# EAGLE design Power PCB final (EAGLE 6.1)
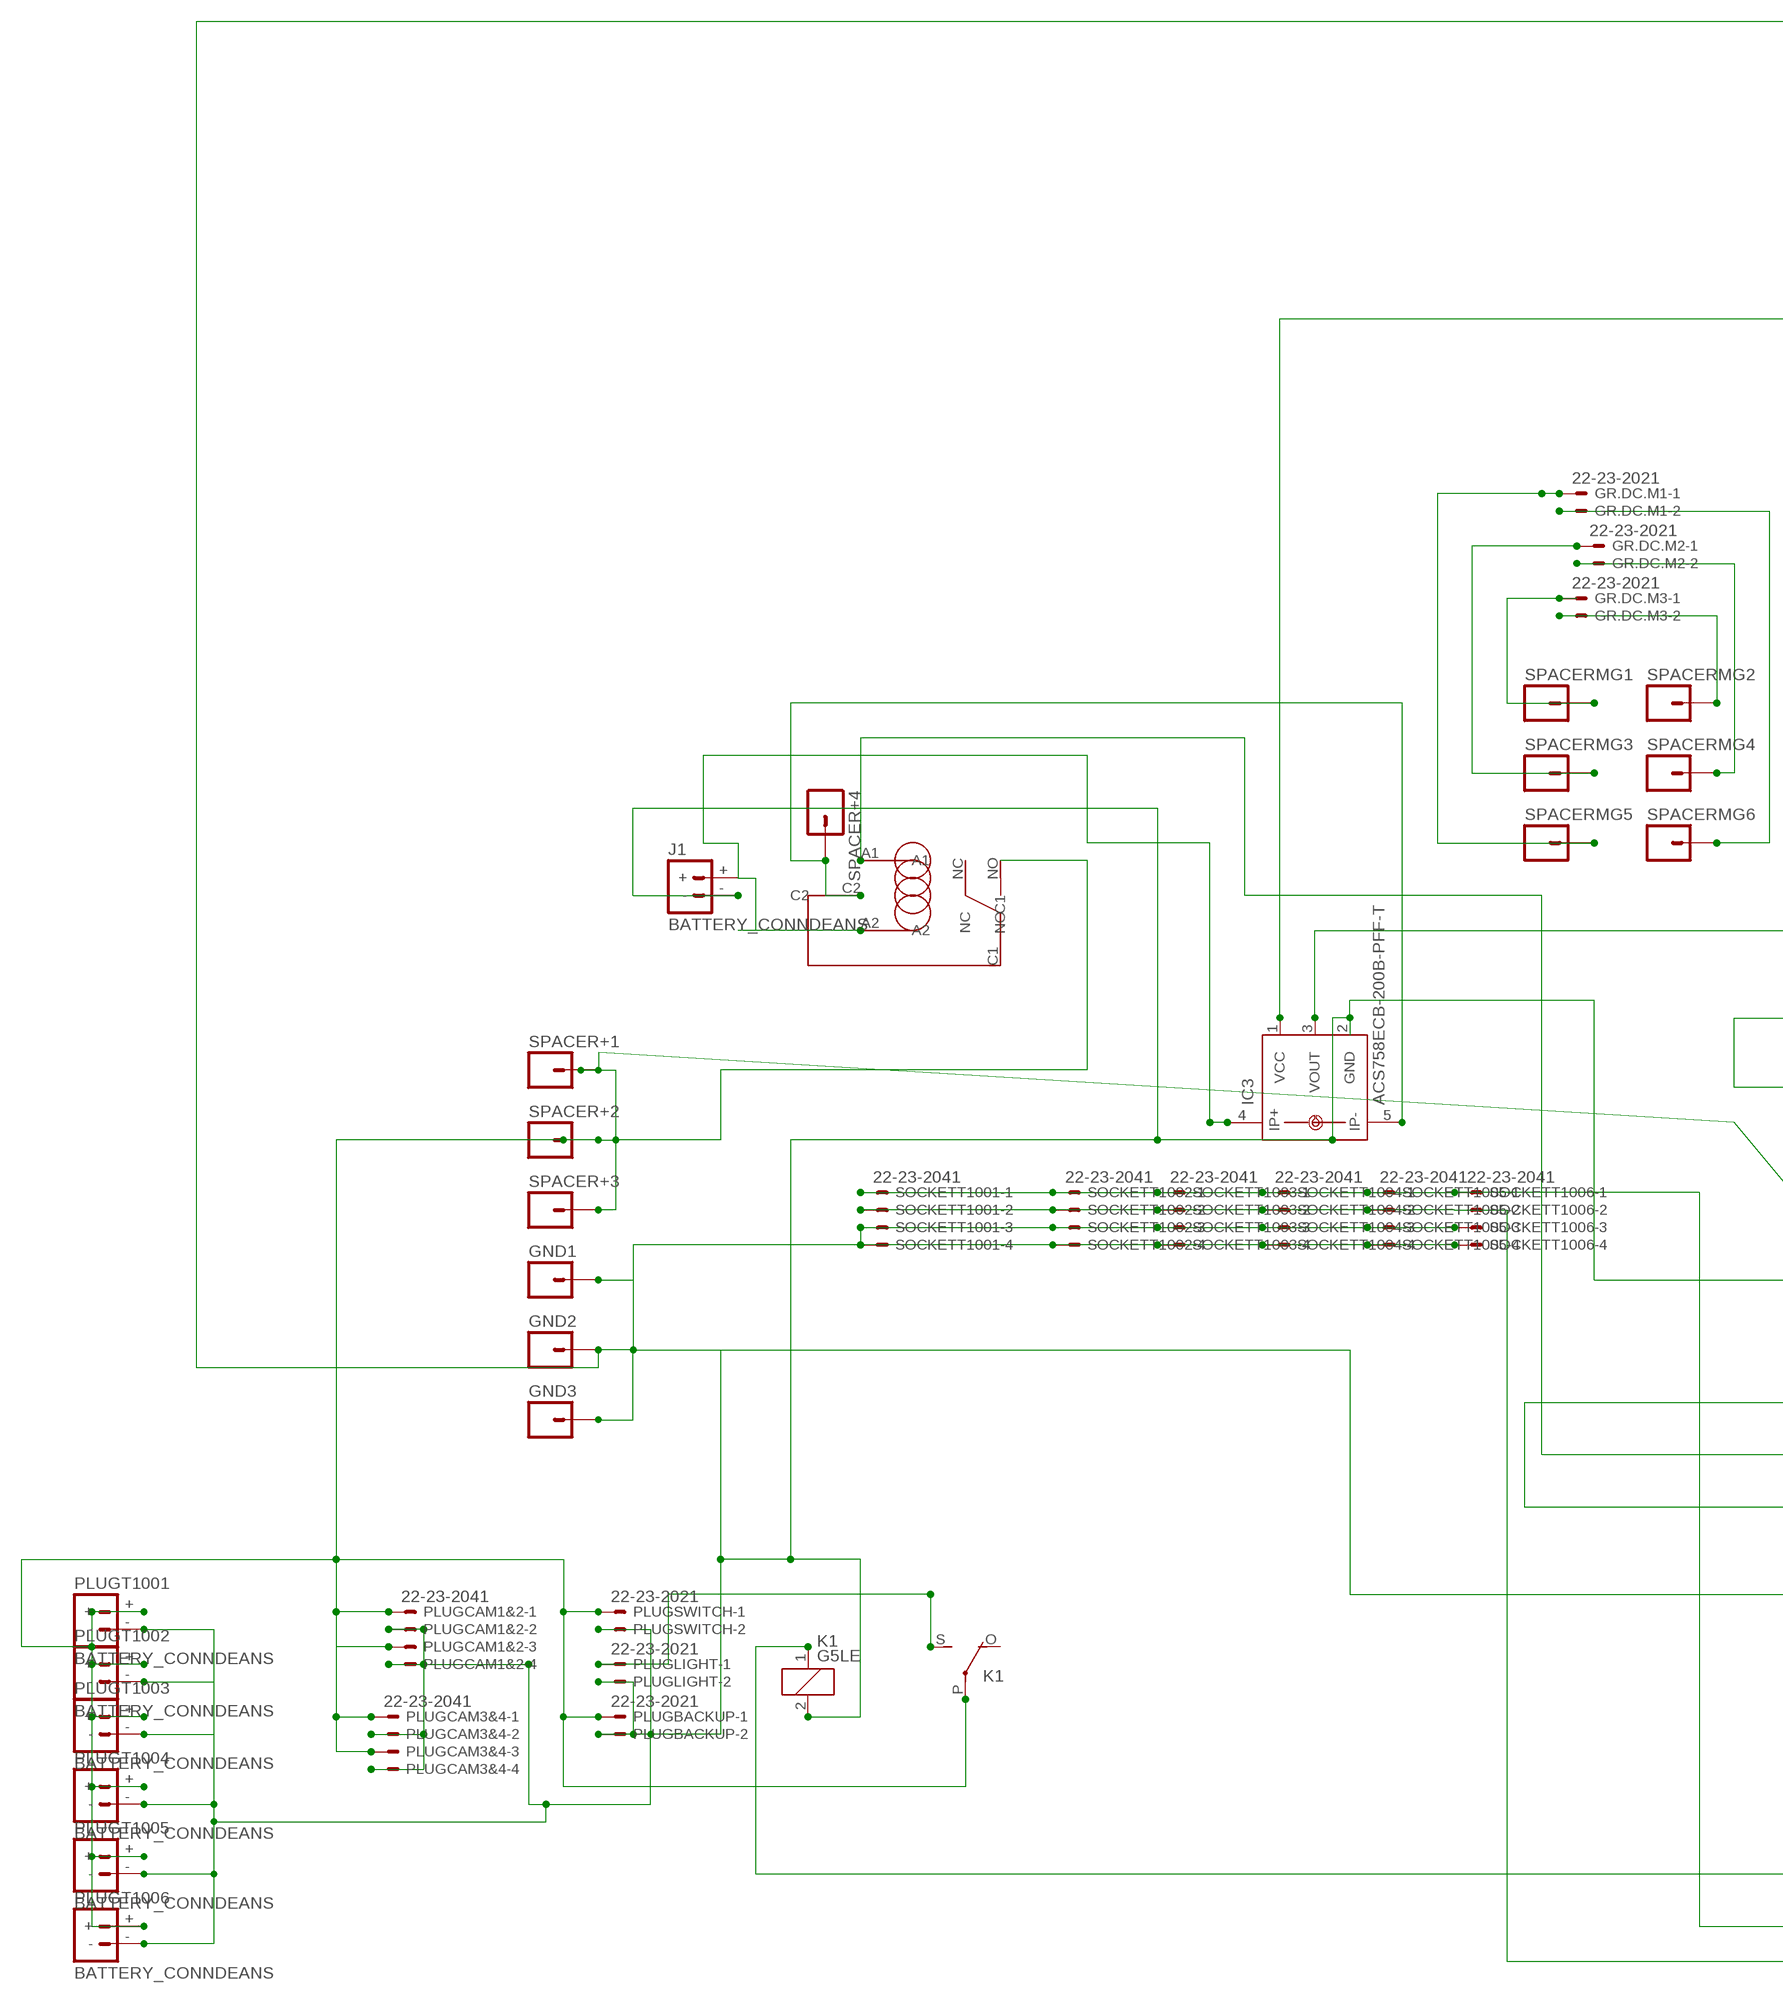
[diagram p0: schematic, sheet 1, part 1 of 2]
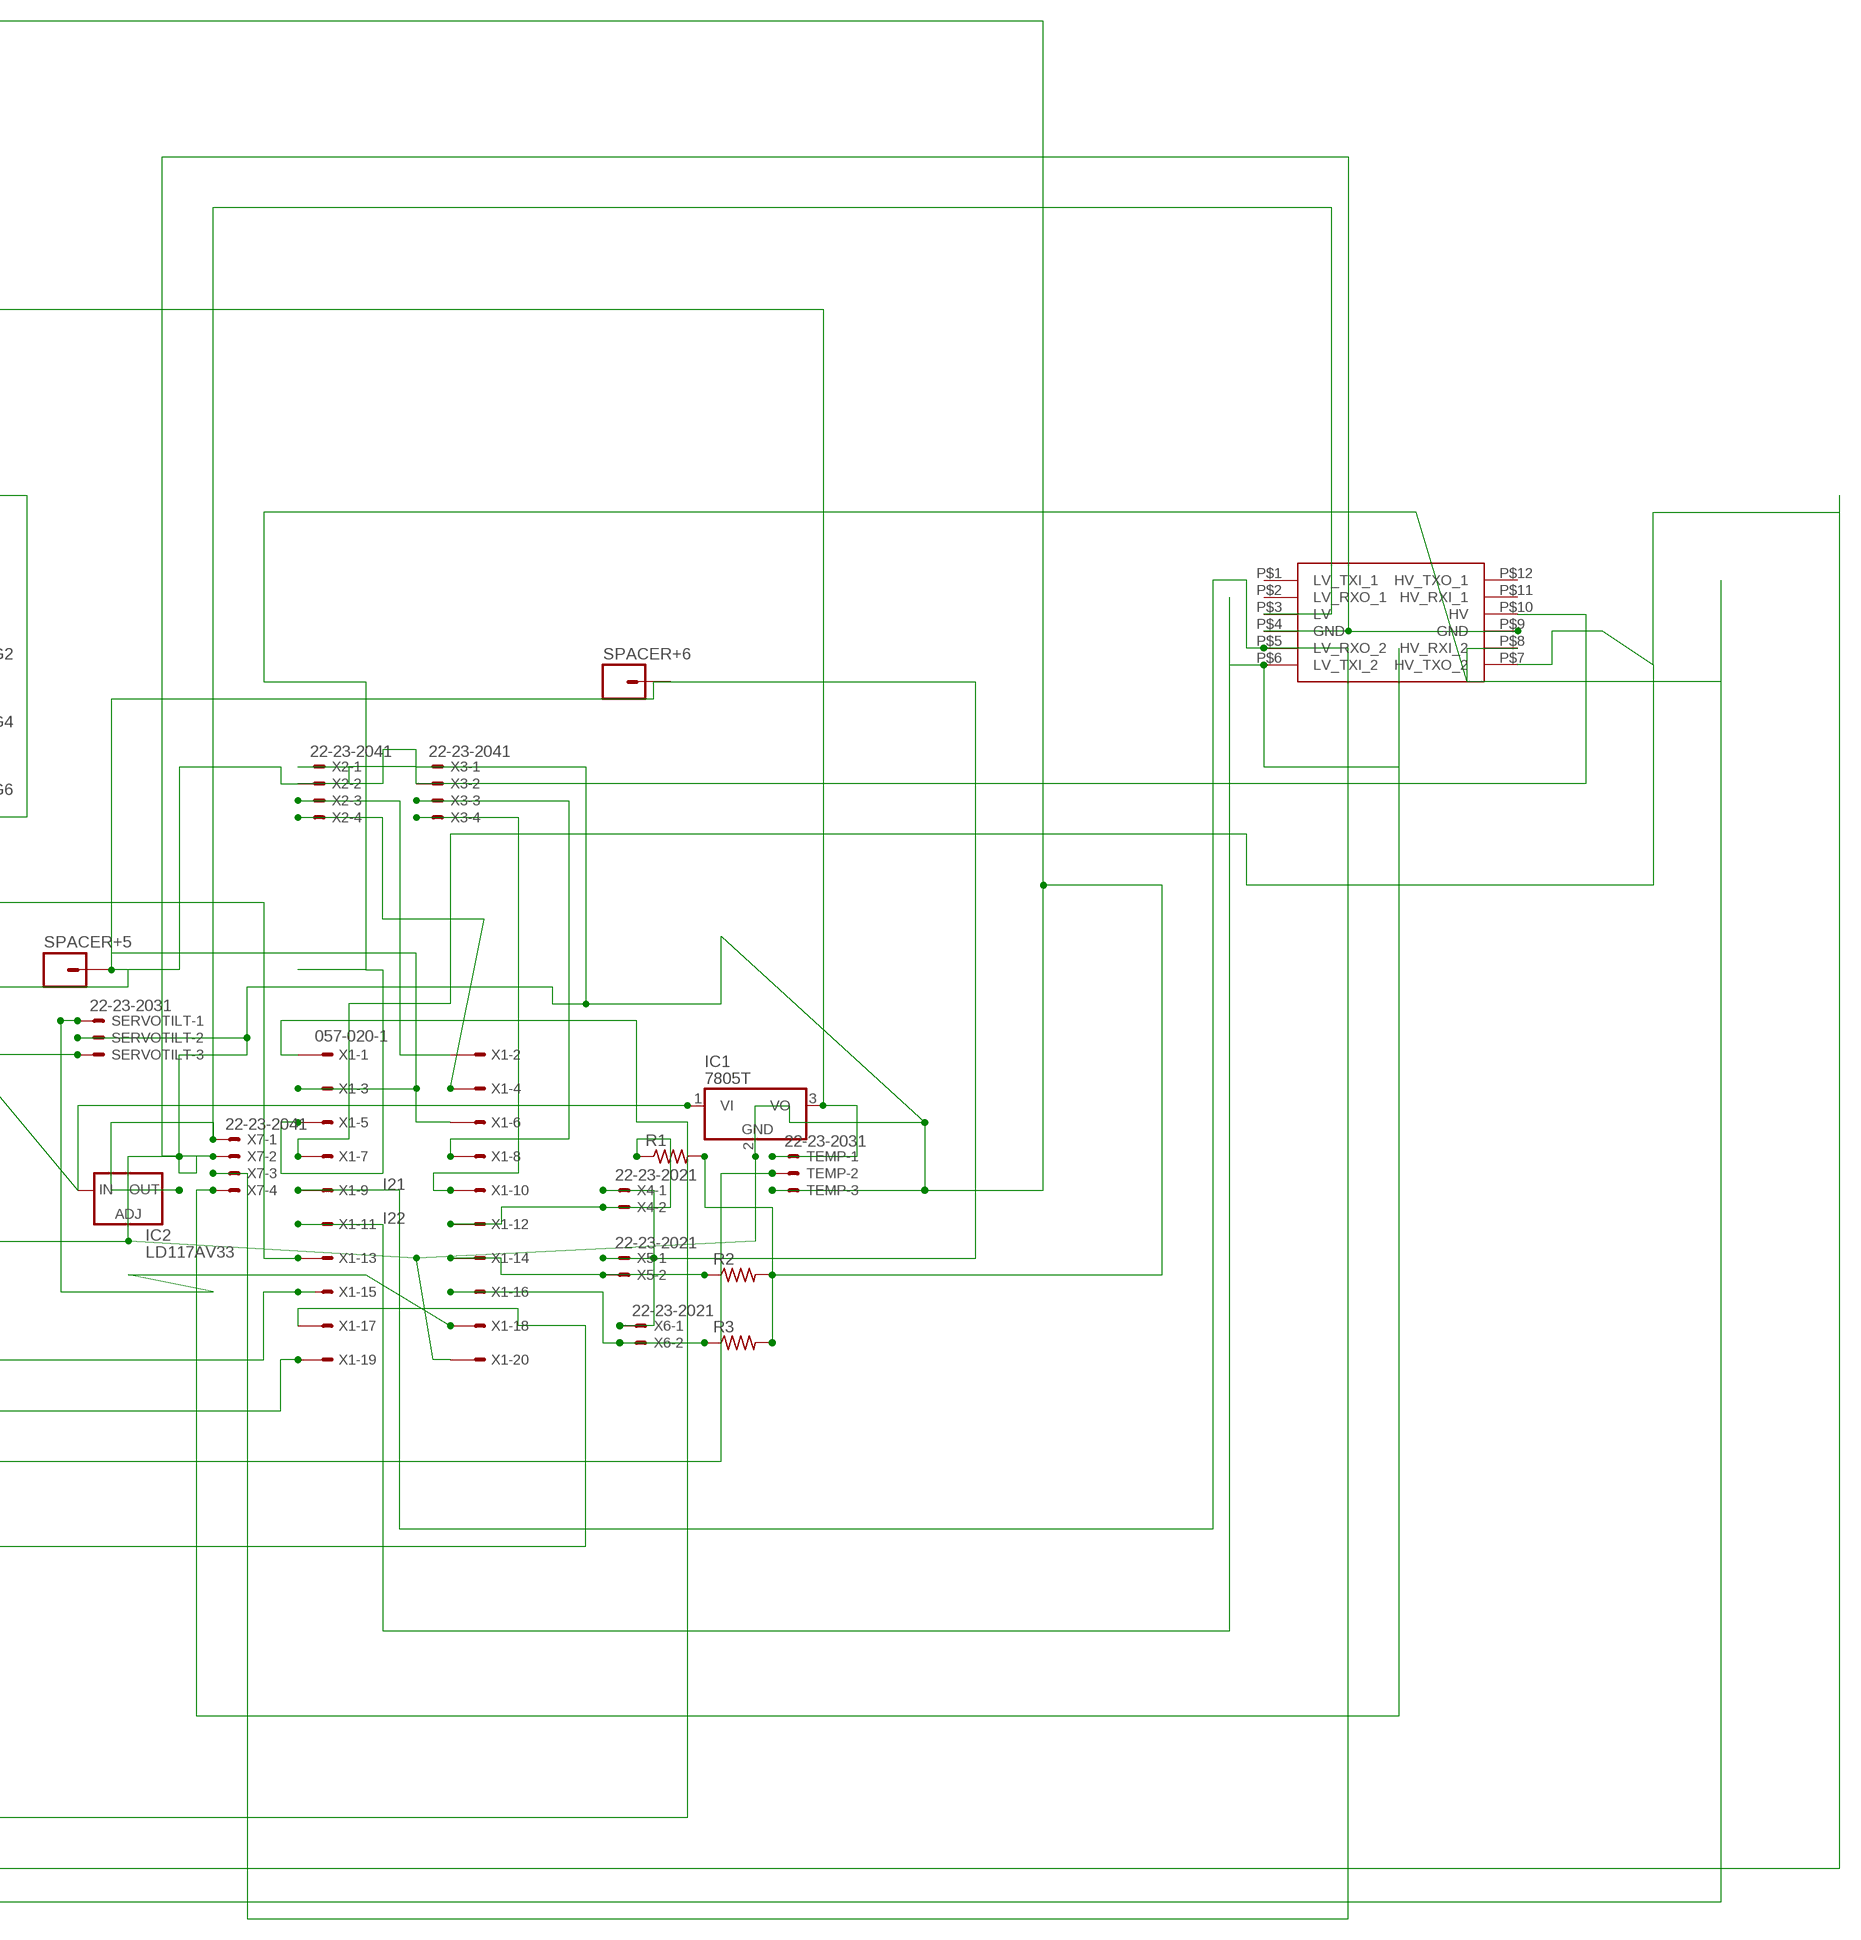
[diagram p1: schematic, sheet 1, part 2 of 2]

## Parts
GND1  M01PTH_2MM  [1X01_2MM]
GND2  M01PTH_2MM  [1X01_2MM]
GND3  M01PTH_2MM  [1X01_2MM]
GR.DC.M1  22-23-2021  [22-23-2021]
GR.DC.M2  22-23-2021  [22-23-2021]
GR.DC.M3  22-23-2021  [22-23-2021]
IC1  7805T  [TO220H]
IC2  LD117AV33  [TO220L1]
IC3  ACS758ECB-200B-PFF-T  [CB-PFF]
J1  BATTERY_CONNDEANS  [DEANS]
K1  G5LE  [G5LE]
PLUGBACKUP  22-23-2021  [22-23-2021]
PLUGCAM1&2  22-23-2041  [22-23-2041]
PLUGCAM3&4  22-23-2041  [22-23-2041]
PLUGLIGHT  22-23-2021  [22-23-2021]
PLUGSWITCH  22-23-2021  [22-23-2021]
PLUGT1001  BATTERY_CONNDEANS  [DEANS]
PLUGT1002  BATTERY_CONNDEANS  [DEANS]
PLUGT1003  BATTERY_CONNDEANS  [DEANS]
PLUGT1004  BATTERY_CONNDEANS  [DEANS]
PLUGT1005  BATTERY_CONNDEANS  [DEANS]
PLUGT1006  BATTERY_CONNDEANS  [DEANS]
R1  R-US_0207/10  [0207/10]
R2  R-US_0207/10  [0207/10]
R3  R-US_0207/10  [0207/10]
SERVOTILT  22-23-2031  [22-23-2031]
SOCKETT1001  22-23-2041  [22-23-2041]
SOCKETT1002  22-23-2041  [22-23-2041]
SOCKETT1003  22-23-2041  [22-23-2041]
SOCKETT1004  22-23-2041  [22-23-2041]
SOCKETT1005  22-23-2041  [22-23-2041]
SOCKETT1006  22-23-2041  [22-23-2041]
SPACER+1  M01PTH_2MM  [1X01_2MM]
SPACER+2  M01PTH_2MM  [1X01_2MM]
SPACER+3  M01PTH_2MM  [1X01_2MM]
SPACER+4  M01PTH_2MM  [1X01_2MM]
SPACER+5  M01PTH_2MM  [1X01_2MM]
SPACER+6  M01PTH_2MM  [1X01_2MM]
SPACERMG1  M01PTH_2MM  [1X01_2MM]
SPACERMG2  M01PTH_2MM  [1X01_2MM]
SPACERMG3  M01PTH_2MM  [1X01_2MM]
SPACERMG4  M01PTH_2MM  [1X01_2MM]
SPACERMG5  M01PTH_2MM  [1X01_2MM]
SPACERMG6  M01PTH_2MM  [1X01_2MM]
TEMP  22-23-2031  [22-23-2031]
U$1  30A_RELAY  [30A_RELAY]
U$2  LOGIC_LEVEL_CONVERTER  [LOGIC_LEVEL_CONVERTER]
X1  057-020-1  [057-020-1]
X2  22-23-2041  [22-23-2041]
X3  22-23-2041  [22-23-2041]
X4  22-23-2021  [22-23-2021]
X5  22-23-2021  [22-23-2021]
X6  22-23-2021  [22-23-2021]
X7  22-23-2041  [22-23-2041]

## Nets
I21: U$2.P$5(LV_RXO_2) X1.9 X7.3
I22: U$2.P$6(LV_TXI_2) X1.11 X7.4
N$1: SOCKETT1001.1 SOCKETT1002.1 SOCKETT1003.1 SOCKETT1004.1 SOCKETT1005.1 SOCKETT1006.1 U$2.P$7(HV_TXO_2) X1.7
N$3: X1.4 X2.4
N$5: IC3.3(VOUT) X1.13
N$6: SOCKETT1001.2 SOCKETT1002.2 SOCKETT1003.2 SOCKETT1004.2 SOCKETT1005.2 SOCKETT1006.2 U$2.P$8(HV_RXI_2) X1.5
N$9: GR.DC.M3.1 SPACERMG1.1
N$10: K1.1 X1.1
N$12: TEMP.2 X1.15
N$15: K1.S(2:S) PLUGLIGHT.1
N$16: GR.DC.M3.2 SPACERMG2.1
N$17: GR.DC.M2.2 SPACERMG4.1
N$18: GR.DC.M2.1 SPACERMG3.1
N$19: GR.DC.M1.2 SPACERMG6.1
N$20: GR.DC.M1.1 SPACERMG5.1
N$21: GND1.1 GND2.1 GND3.1 IC1.2(GND) IC2.1(ADJ) IC3.2(GND) J1.- K1.2 PLUGBACKUP.2 PLUGCAM1&2.2 PLUGCAM1&2.4 PLUGCAM3&4.2 PLUGCAM3&4.4 PLUGLIGHT.2 PLUGSWITCH.2 PLUGT1001.- PLUGT1002.- PLUGT1003.- PLUGT1004.- PLUGT1005.- PLUGT1006.- R1.2 R2.2 R3.2 SERVOTILT.2 SOCKETT1001.3 SOCKETT1001.4 SOCKETT1002.3 SOCKETT1002.4 SOCKETT1003.3 SOCKETT1003.4 SOCKETT1004.3 SOCKETT1004.4 SOCKETT1005.3 SOCKETT1005.4 SOCKETT1006.3 SOCKETT1006.4 TEMP.3 U$2.P$4(GND) U$2.P$9(GND) X1.17 X1.20 X2.1 X3.1 X7.2
N$24: IC3.5(IP-) SPACER+4.1 U$1.C2
N$25: X1.10 X3.4
N$26: X1.8 X3.3
N$27: X1.2 X2.3
N$28: SERVOTILT.1 X1.18
N$44: IC2.2(OUT) U$2.P$3(LV) X7.1
N$45: U$1.A1 X1.19
N$48: IC1.3(VO) IC3.1(VCC) TEMP.1
N$49: IC3.4(IP+) J1.+ U$1.A2
N$52: IC1.1(VI) IC2.3(IN) K1.P(2:P) PLUGBACKUP.1 PLUGCAM1&2.1 PLUGCAM1&2.3 PLUGCAM3&4.1 PLUGCAM3&4.3 PLUGSWITCH.1 PLUGT1001.+ PLUGT1002.+ PLUGT1003.+ PLUGT1004.+ PLUGT1005.+ PLUGT1006.+ SPACER+1.1 SPACER+2.1 SPACER+3.1 U$1.NO
N$55: R1.1 X1.12 X4.2
N$56: R2.1 X1.14 X5.2
N$57: R3.1 X1.16 X6.2
N$79: SERVOTILT.3 SPACER+5.1 SPACER+6.1 U$2.P$10(HV) X1.3 X1.6 X2.2 X3.2 X4.1 X5.1 X6.1
Unconnected: IC3.IP+1 IC3.IP-1 K1.O(2:O) U$1.C1 U$1.NC U$2.P$1(LV_TXI_1) U$2.P$2(LV_RXO_1) U$2.P$11(HV_RXI_1) U$2.P$12(HV_TXO_1)

## Library data of the parts
GND1-GND3 SPACER+1-SPACER+6 SPACERMG1-SPACERMG6 = SparkFun-Connectors:M01: Header 1 Standard 1-pin 0.1" header. Use with straight break away headers (SKU : PRT-00116), right angle break away headers (PRT-00553), swiss pins (PRT-00743), machine pins (PRT-00117), and female headers (PRT-00115).
GR.DC.M1-GR.DC.M3 PLUGBACKUP PLUGLIGHT PLUGSWITCH X4-X6 = con-molex:22-23-2021: .100" (2.54mm) Center Header - 2 Pin; MF: MOLEX; MPN: 22-23-2021; OC_FARNELL: 1462926; OC_NEWARK: 25C3832
IC1 = linear:78*: Positive VOLTAGE REGULATOR Source: http://cache.national.com/ds/LM/LM78L05.pdf http://www.fairchildsemi.com/ds/LM/LM7805.pdf
IC2 = v-reg:LD117A?*: Low drop fixed and adjustable positive voltage regulators 1 A Source: http://www.st.com/stonline/products/literature/ds/7194/ld1117axx.pdf
IC3 = allegro:ACS758*: Thermally Enhanced, Fully Integrated, Hall Effect-Based Linear Current Sensor with 100 micro Ohm Current Conductor display layer 49 Reference in BRD and place VIAs on circles Source: http://www.allegromicro.com/en/Products/Part_Numbers/0758/0758.pdf; MPN: ACS758ECB-200B-PFF-T; OC_FARNELL: 1718993; OC_NEWARK: 04R7127
J1 PLUGT1001-PLUGT1006 = SparkFun-Connectors:BATTERY_CONN: Various footprints for battery connectors
K1 = relay:G5LE: RELAY 1 x switch, 10 A/120 V AC, 8 A/30 V DC, Omron; OC_FARNELL: unknown; OC_NEWARK: unknown
PLUGCAM1&2 PLUGCAM3&4 SOCKETT1001-SOCKETT1006 X2 X3 X7 = con-molex:22-23-2041: .100" (2.54mm) Center Header - 4 Pin; MF: MOLEX; MPN: 22-23-2041; OC_FARNELL: 1462920; OC_NEWARK: 38C0355
R1-R3 = resistor:R-US_: RESISTOR, American symbol
SERVOTILT TEMP = con-molex:22-23-2031: .100" (2.54mm) Center Header - 3 Pin; MF: MOLEX; MPN: 22-23-2031; OC_FARNELL: 1462950; OC_NEWARK: 30C0862
U$1 = ir:30A_RELAY
U$2 = SparkFun-Boards:LOGIC_LEVEL_CONVERTER: Logic Level Converter (3.3v - 5v) https://www.sparkfun.com/products/8745
X1 = con-panduit:057-020-: CONNECTOR 20-pin series 057 contact pc board low profile headers; OC_FARNELL: unknown; OC_NEWARK: unknown

## Board
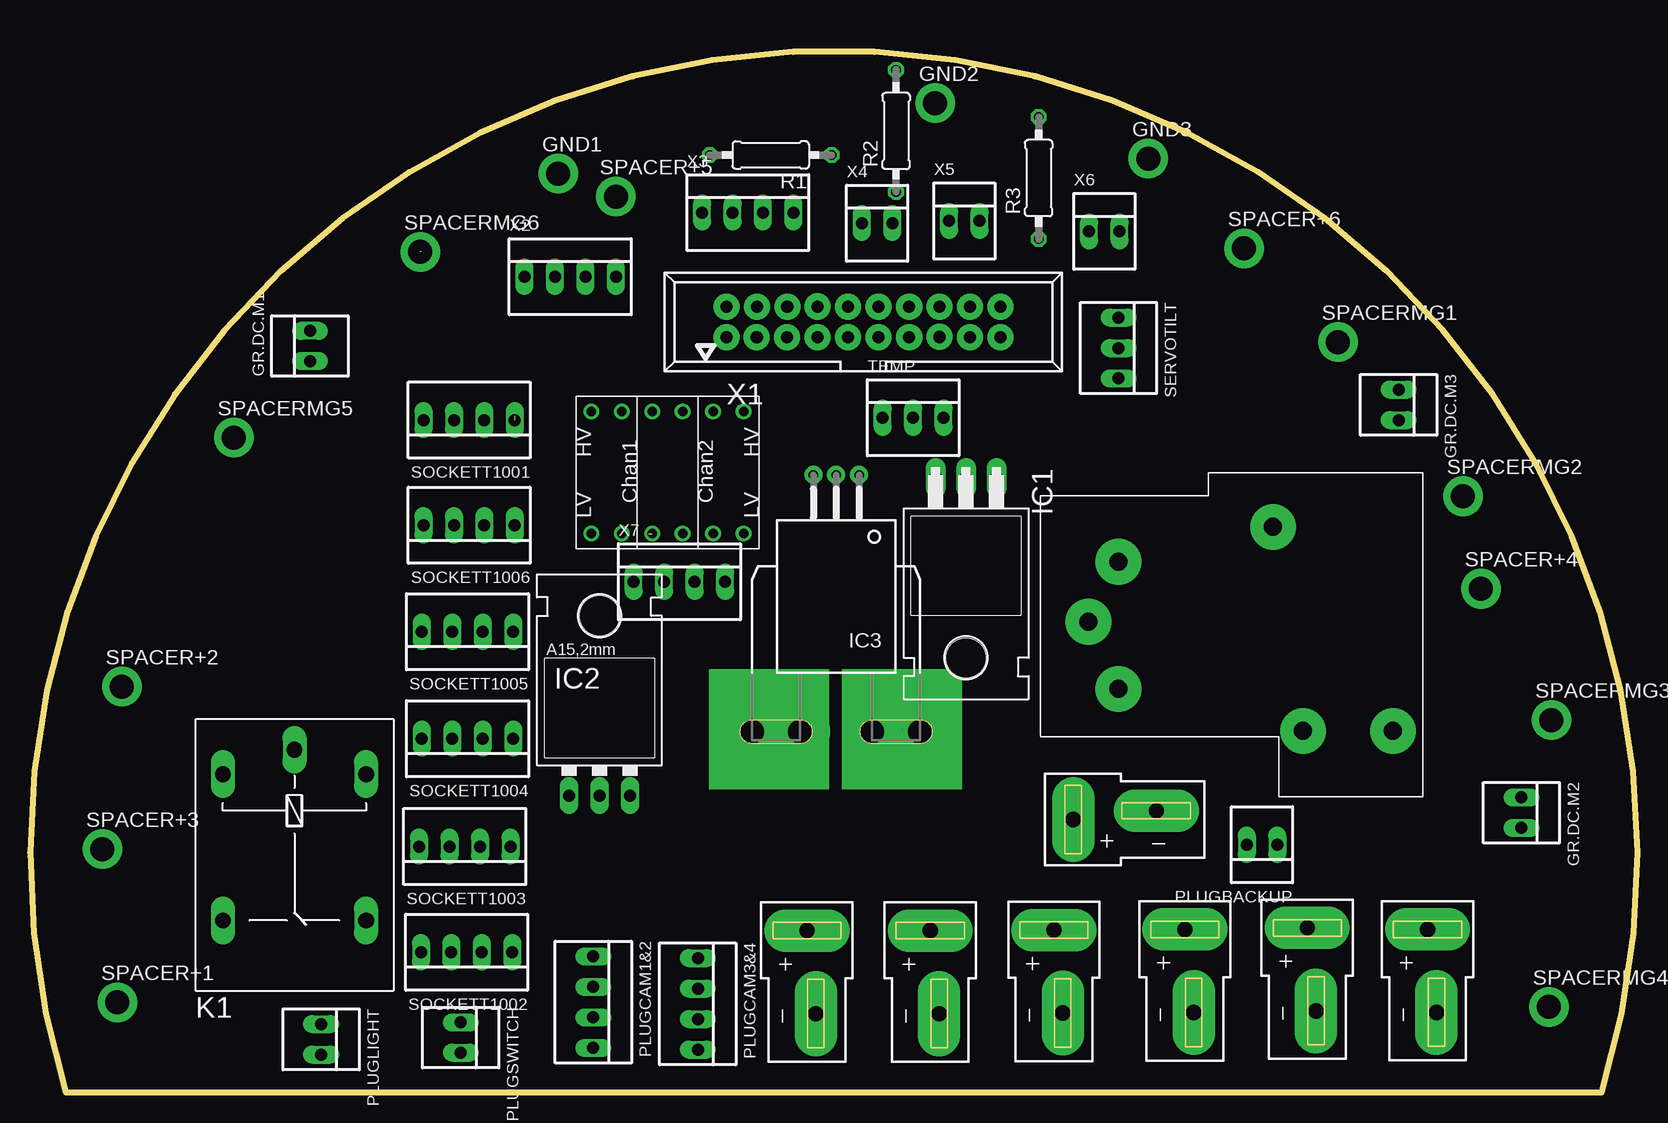
[diagram p2: board, top side]
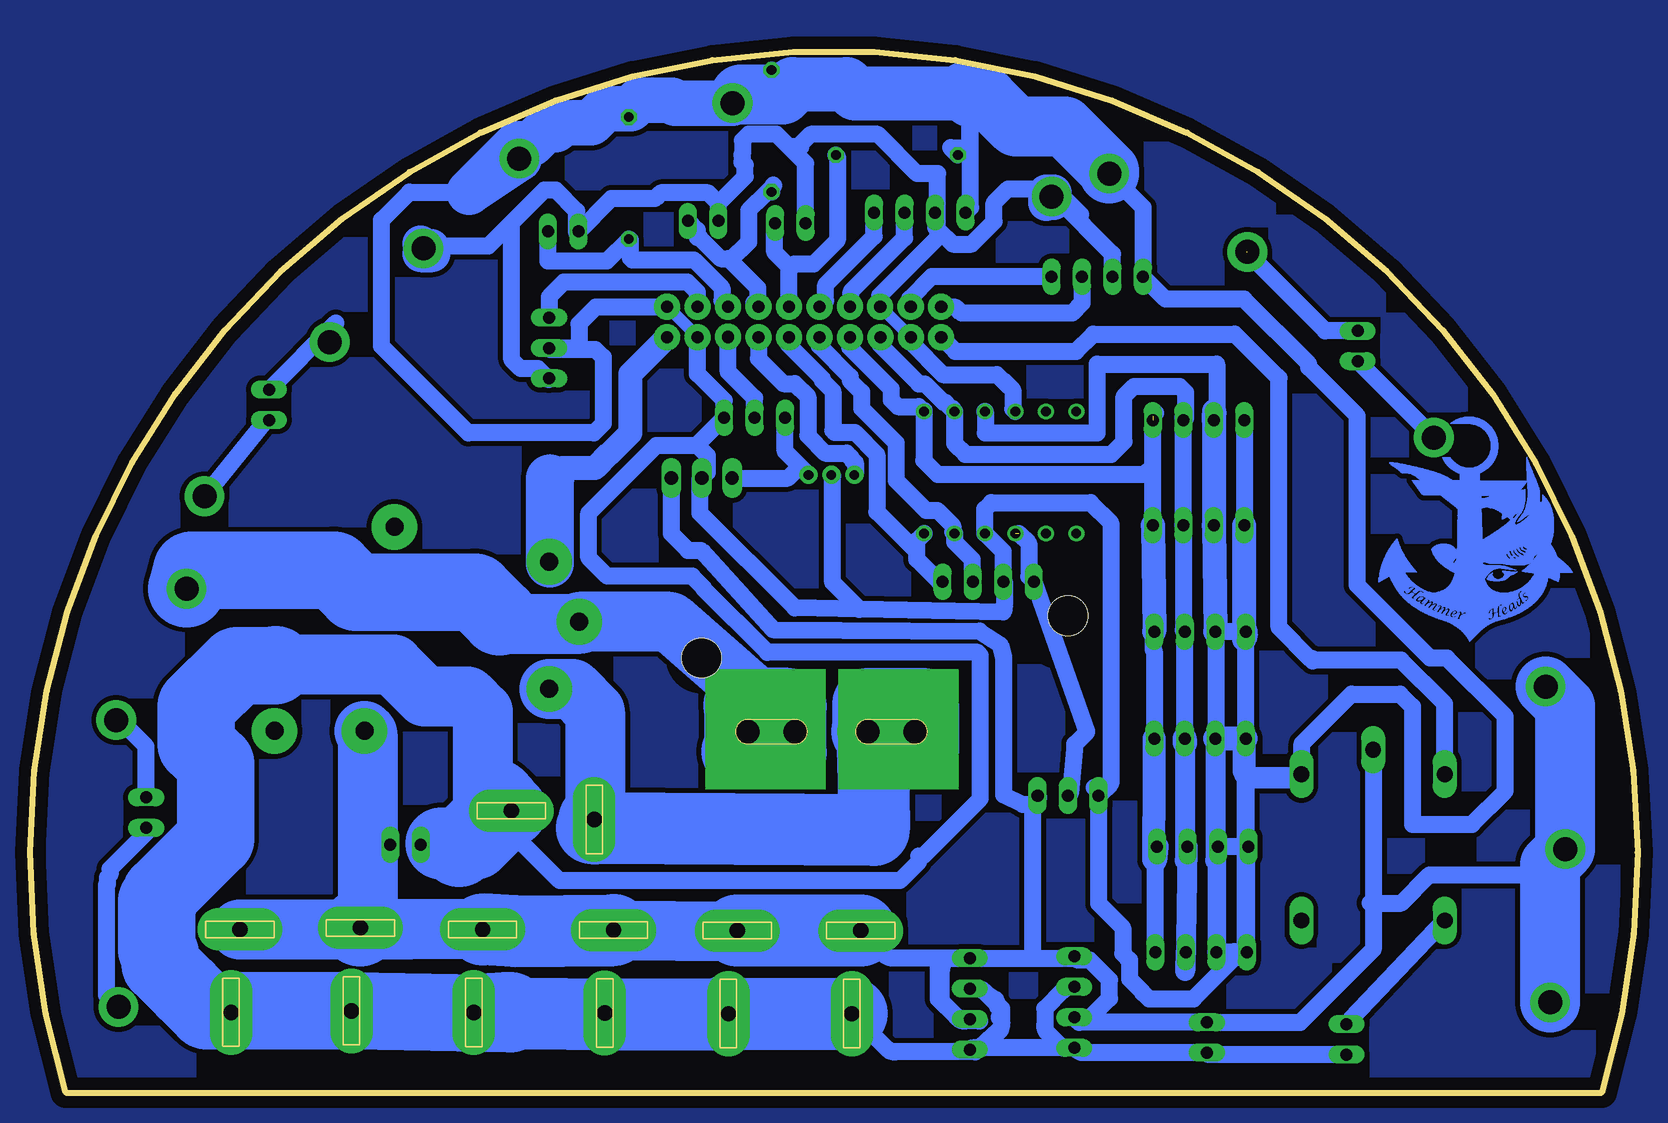
[diagram p3: board, bottom side, seen from below]

Size 134.01 x 86.73 mm. Coordinates in mm from the lower left corner, seen from the top.
Outline: 131.01,0 arc214 3,0 131.01,0
Copper layers (1*16): Top 0.035mm / dielectric 1.5mm / Bottom 0.035mm
Design rules: minimum track width 10mil, minimum drill 24mil, track to track 8mil, track to pad 8mil, pad to pad 8mil, via to via 8mil, smd to smd 8mil, copper to edge 40mil, drill to drill 8mil, minimum pad ring 10mil, minimum via ring 8mil, stop-mask expansion 4mil, vias tented up to drill 0mil, thermal gap 10mil

### Footprints (pad centres in the part's own frame; a part is rotated, then mirrored left to right if it is on the bottom)
1X01_2MM = drill 2 pad 3.302: 1 0,0
22-23-2021 = drill 1 long: 1 -1.27,0; 2 1.27,0
TO220H = drill 1.118 long: 1 -2.54,-10.16; 2 0,-10.16; 3 2.54,-10.16 | hole 3.302: 0,4.826
TO220L1 = drill 1.016 long: 1 -2.54,-3.81; 2 0,-3.81; 3 2.54,-3.81 | hole 3.302: 0,11.176
CB-PFF = drill 0.8 pad 1.5: 1 -1.91,-21.4; 2 0,-21.4; 3 1.91,-21.4 | drill 2 pad 5 offset: 4 3,0; 5 -3,0 | drill 2 pad 4 offset: IP+1 7,0; IP-1 -7,0
DEANS = drill 1.27 pad 3.556 long: + 0,0; - 0.737,-6.921
G5LE = drill 1.321 long: 1 -7.493,-5.969; 2 -7.493,5.969; O 4.699,5.969; P -9.525,0; S 4.699,-5.969
22-23-2041 = drill 1 long: 1 -3.81,0; 2 -1.27,0; 3 1.27,0; 4 3.81,0
0207/10 = drill 0.813 octagon: 1 -5.08,0; 2 5.08,0
22-23-2031 = drill 1 long: 1 -2.54,0; 2 0,0; 3 2.54,0
30A_RELAY = drill 1.5 pad 3.81: A1 29.1,-19.8; A2 39.7,-19.8; C1 26.2,-6.9; C2 34.1,-22.3; NC 43.2,3.1; NO 43.2,-4.4
LOGIC_LEVEL_CONVERTER = drill 0.8: P$1 1.27,13.97; P$2 1.27,11.43; P$3 1.27,8.89; P$4 1.27,6.35; P$5 1.27,3.81; P$6 1.27,1.27; P$7 11.43,1.27; P$8 11.43,3.81; P$9 11.43,6.35; P$10 11.43,8.89; P$11 11.43,11.43; P$12 11.43,13.97
057-020-1 = drill 1 octagon: 1 -11.43,-1.27; 2 -11.43,1.27; 3 -8.89,-1.27; 4 -8.89,1.27; 5 -6.35,-1.27; 6 -6.35,1.27; 7 -3.81,-1.27; 8 -3.81,1.27; 9 -1.27,-1.27; 10 -1.27,1.27; 11 1.27,-1.27; 12 1.27,1.27; 13 3.81,-1.27; 14 3.81,1.27; 15 6.35,-1.27; 16 6.35,1.27; 17 8.89,-1.27; 18 8.89,1.27; 19 11.43,-1.27; 20 11.43,1.27

### Placement (x,y rotation side)
GND1  44.04,76.58 0 top
GND2  75.44,82.46 0 top
GND3  93.22,77.84 0 top
GR.DC.M1  23.33,62.22 90 top
GR.DC.M2  124.32,23.32 270 top
GR.DC.M3  114.08,57.32 270 top
IC1  78.02,41.05 180 top
IC2  47.47,28.56 0 top
IC3  67.2,30.08 180 top
J1  86.97,22.75 90 top
K1  22.05,19.05 270 top
PLUGBACKUP  102.7,20.66 180 top
PLUGCAM1&2  46.95,7.54 270 top
PLUGCAM3&4  55.67,7.4 270 top
PLUGLIGHT  24.27,4.44 270 top
PLUGSWITCH  35.9,4.59 270 top
PLUGT1001  96.27,13.6 0 top
PLUGT1002  85.36,13.55 0 top
PLUGT1003  75.05,13.5 0 top
PLUGT1004  116.51,13.6 0 top
PLUGT1005  106.47,13.73 0 top
PLUGT1006  64.77,13.5 0 top
R1  61.74,78.13 180 top
R2  72.19,80.14 90 top
R3  84.08,76.21 90 top
SERVOTILT  90.74,62.05 270 top
SOCKETT1001  36.6,56.05 180 top
SOCKETT1002  36.39,11.7 180 top
SOCKETT1003  36.25,20.51 180 top
SOCKETT1004  36.47,29.5 180 top
SOCKETT1005  36.47,38.41 180 top
SOCKETT1006  36.6,47.28 180 top
SPACER+1  7.29,7.53 0 top
SPACER+2  7.66,33.83 0 top
SPACER+3  6.03,20.29 0 top
SPACER+4  120.95,41.99 0 top
SPACER+5  48.84,74.67 0 top
SPACER+6  101.2,70.35 0 top
SPACERMG1  109.03,62.55 0 top
SPACERMG2  119.46,49.7 0 top
SPACERMG3  126.82,31.05 0 top
SPACERMG4  126.62,7.14 0 top
SPACERMG5  16.99,54.58 0 top
SPACERMG6  32.53,70.06 0 top
TEMP  73.61,56.24 0 top
U$1  110.52,73.34 270 top
U$2  60.75,45.32 90 top
X1  69.47,64.21 0 top
X2  45.03,67.99 0 top
X3  59.83,73.33 0 top
X4  70.61,72.45 0 top
X5  77.88,72.64 0 top
X6  89.55,71.77 0 top
X7  54.13,42.57 0 top

### Tracks (layer width: path | path; a pad name or v marks a point on that pad's centre or on a via)
I21
  Bottom 1.422: X7.3 55.48,42.65 55.48,44.43 56.94,45.89 U$2.P$5 57.07,46.72 57.07,47.23 58.36,48.52 59.31,48.52 61.79,51 61.79,54.13 64.68,57.02 64.68,58.38 65.64,59.34 65.64,59.66 68.2,62.22 X1.9
I22
  Bottom 1.422: X7.4 58.21,42.57 60.08,44.44 60.08,45.07 | 60.08,45.07 60.08,45.99 U$2.P$6 | X1.11 70.74,62.28 67.96,59.5 67.96,59.34 67.08,58.46 67.08,55.17 66.92,55.01 65.24,55.01 63.4,53.17 63.4,48.39 60.08,45.07
N$1  (1 unrouted)
  Bottom 1.422: 40.39,47.25 40.39,36.91 40.28,36.8 SOCKETT1004.1 40.32,29.31 40.32,30.22 | SOCKETT1002.1 40.21,20.36 SOCKETT1003.1 | SOCKETT1006.1 40.41,52.16 | 40.41,52.16 40.41,56.38 40.17,56.62 | X1.7 65.66,62.08 62.23,58.65 62.23,57.73 61.67,57.17 59.9,57.17 U$2.P$7 59.48,56.83 59.49,56.84 59.49,52.66 58.34,51.51 41.06,51.51 40.41,52.16
  Bottom 1.93: 40.21,19.28 SOCKETT1003.1 40.33,19.41 40.33,22.81 40.28,22.86 SOCKETT1004.1
  Bottom 2: SOCKETT1006.1 40.39,47.25 SOCKETT1005.1
N$2  (via drill 1 pad 2.18)
  other vias: 58.06,65.49
N$3
  Bottom 1.422: X2.4 58.84,67.99 60.67,66.16 60.67,65.57 X1.4
N$5
  Bottom 1.422: X1.13 73.28,61.17 71.2,59.09 70.26,59.09 69.17,58 69.17,54.75 67.72,53.3 65.93,53.3 65.59,52.96 65.59,52.88 65.2,52.49 65.2,51.57 IC3.3
N$6
  Bottom 1.422: 37.71,10.09 37.71,30.34 37.74,30.37 SOCKETT1005.2 37.87,38.54 SOCKETT1006.2 37.91,47.32 37.91,56.25 37.87,56.21 SOCKETT1001.2 37.69,56.23 37.69,58.36 38.19,58.86 41.97,58.86 42.81,58.02 42.81,54.24 43.86,53.19 56.04,53.19 56.94,54.09 U$2.P$8 | 37.71,10.09 37.66,10.04 37.66,10.08 | 37.66,10.08 37.66,10.11 | 37.66,10.11 37.7,10.15 | 37.7,10.15 37.7,10.12 37.66,10.08 | 37.66,10.11 37.66,10.19 37.7,10.23 37.7,10.15 | 37.71,10.09 37.67,10.14 SOCKETT1002.2 37.65,10.13 | 57.07,57.02 57.07,56.88 U$2.P$8 | X1.5 63.12,62.28 59.91,59.07 59.41,59.07 57.83,57.49 57.68,57.49 U$2.P$8
  Bottom 1.676: SOCKETT1004.2 37.74,19.34 SOCKETT1003.2 37.72,10.14 SOCKETT1002.2
  Bottom 2: SOCKETT1004.2 37.74,29.17 37.72,29.15
N$7
  pour Bottom (isolate 0.406): -8.59,93.53 139.92,93.53 139.92,-7.33 -8.54,-7.33
N$8  (via drill 1 pad 2.18)
  other vias: 60.59,65.49
N$9
  Bottom 1.422: GR.DC.M3.1 108.52,64.15 SPACERMG1.1
N$10
  Bottom 1.422: 27.1,35.97 27.22,36.09 | 27.22,36.09 29.89,38.76 29.89,59.55 29.98,59.64 30.01,59.64 33.57,63.2 45.37,63.2 46.81,61.76 56.86,61.76 X1.1 | K1.1 16.08,32.39 19.73,36.04 27.01,36.04 27.14,36.17 27.22,36.09
N$12
  Bottom 1.422: TEMP.2 73.61,57.88 75.8,60.07 75.8,62.92 X1.15
N$15
  Bottom 1.422: K1.S 23.93,6.06 PLUGLIGHT.1
N$16
  Bottom 1.422: SPACERMG2.1 114.3,56.05 GR.DC.M3.2
N$17
  Bottom 1.422: GR.DC.M2.2 124.32,21.64 127.32,18.64 127.32,18.16 127.55,17.93 127.55,17.39 127.63,17.31 127.63,8.15 SPACERMG4.1
N$18
  Bottom 1.422: GR.DC.M2.1 124.32,28.86 126.61,31.15 126.7,31.15 | 126.7,31.15 126.77,31.22 | SPACERMG3.1 126.81,31.05 126.7,31.15
N$19  (1 unrouted)
  Bottom 1.422: GR.DC.M1.2 26.03,63.49 32.62,70.08 32.62,69.92
N$20
  Bottom 1.422: SPACERMG5.1 16.99,54.6 GR.DC.M1.1
N$21
  Bottom 1.016: X1.17 78.36,62.99 80.9,65.53 X1.20
  Bottom 1.27: 54.99,36.69 54.99,36.65 54.86,36.52
  Bottom 1.422: PLUGBACKUP.2 101.12,20.35 98.22,20.35 | 95.43,23.15 95.11,23.46 94.3,23.46 | 93.89,23.46 94.3,23.46 | 94.3,23.46 94.16,23.32 | 93.89,23.32 94.16,23.32 | 94.16,23.32 94.3,23.32 | 35.15,29.65 35.15,38.36 SOCKETT1005.3 33.05,38.41 32.81,38.64 32.81,38.56 SOCKETT1005.4 32.66,11.77 SOCKETT1002.4 32.59,20.36 | 46.93,3.72 46.99,3.78 | 47.93,3.73 PLUGCAM1&2.4 arc45 46.93,3.72 | 47.93,3.73 54.57,3.73 | 54.57,3.73 55.34,3.73 arc-45 PLUGCAM3&4.4 | 46.93,3.72 46.83,3.62 arc-45 46.12,3.32 PLUGSWITCH.2 35.75,3.17 PLUGLIGHT.2 | PLUGCAM1&2.2 47.19,8.81 arc-45 47.9,8.51 49.42,6.99 49.42,5.63 arc-45 49.13,4.92 47.93,3.73 | 54.57,3.73 53.31,4.99 arc-45 53.01,5.7 53.01,6.99 54.4,8.38 arc-45 55.11,8.67 PLUGCAM3&4.2 55.12,8.67 arc45 54.41,8.38 53.52,7.77 arc-45 53.42,7.53 53.32,7.15 53.04,6.52 arc-45 53.21,6.25 53.17,6.21 53,5.86 arc45 53.29,5.15 55.2,3.39 61.9,3.39 arc45 62.61,3.68 PLUGT1006.- | 32.59,20.36 SOCKETT1003.4 | SOCKETT1001.4 SOCKETT1006.4 | X1.17 78.36,59.89 76.15,57.68 TEMP.3 78.45,53.94 | R3.2 82.92,82.46 GND2.1 75.44,82.48 74.75,83.17 | J1.- 93.89,21.71 89.85,17.67 61.49,17.67 59.91,19.25 59.91,19.7 59.57,19.7 54.78,24.49 54.78,36.44 54.86,36.52 | 32.59,20.36 32.73,20.51 SOCKETT1003.3 34.98,11.85 SOCKETT1002.3 35.13,29.38 35.18,29.44 33.15,29.44 33.06,29.53 33.06,26.74 32.39,26.07 27.97,26.07 27.97,29.08 23.84,33.21 19.8,33.21 18.76,32.17 18.76,22.35 13.8,22.35 11.03,25.12 11.03,31.36 15.88,36.21 17.29,36.21 23.36,42.28 23.36,56.4 27.4,60.44 27.4,60.72 32.8,66.12 39.35,66.12 X2.1 41.22,73.77 GND1.1 | 123.45,11.89 123.45,19.55 119.67,23.33 | R2.2 71.95,84.98 71.95,83.75 72.21,83.49 72.21,83.17
  Bottom 1.422: 55.6,81.85 55.54,81.91 55.54,82.91 | X3.1 55.6,73.75 55.6,81.85 | R1.2 57.27,78.74 55.67,78.74 55.67,81.78 | 55.67,81.78 55.67,81.93 | 55.6,81.85 55.67,81.78 | X1.20 80.92,65.46 86.84,65.46 88.24,64.06 88.24,62.3 88.5,62.05 SERVOTILT.2 90.62,61.93 86.88,61.93 86.23,61.28 86.23,55.74 86.99,54.98 97.48,54.98 104.7,62.2 104.7,72.71 102.38,75.04 97.4,75.04 | 54.99,36.69 72.53,36.69 77.88,42.04 77.88,42.11 78.8,43.03 85.88,43.03 87.44,44.59 87.44,48.29 81.79,53.94 78.45,53.94 | 78.45,53.94 78.38,53.94 77.55,53.11 77.55,51.68 IC1.2 78.15,51.08 78.15,48.29 70.25,40.39 64.86,40.26 | IC2.1 44.93,15.76 42.9,13.73 42.9,11.6 42.35,11.05 42.35,9.47 41.24,8.36 41.24,8.32 40.73,7.81 37.02,7.81 33.64,11.19 34.06,11.61 34.24,11.61 34.16,11.7 33.64,11.7 | 64.86,40.26 52.88,40.04 52.79,40.65 52.79,42.6 52.82,42.57 X7.2 52.86,45.08 54.4,46.62 | 64.86,40.26 67.09,42.52 67.09,51.37 IC3.2 | 54.4,46.62 U$2.P$4 | 54.4,46.62 54.4,48.62 53.86,49.16 45.6,49.16 43.92,47.48 43.92,25.74 44.8,24.86 44.88,24.86 44.88,25.02 45.28,25.42 | U$2.P$9 54.37,56.75 54.37,54.97 45.03,54.97 45.03,60.7 35.08,60.7 35.08,55.91 35.33,55.91 SOCKETT1001.3
  Bottom 1.5: SOCKETT1004.4 32.88,26.45 | SOCKETT1002.3 33.64,11.7 32.67,11.7 32.67,29.4 32.6,29.4 32.6,26.39 28.02,26.39 K1.2
  Bottom 1.676: SOCKETT1004.3 35.2,19.34 SOCKETT1003.3
  Bottom 2: SOCKETT1001.3 35.28,56.79 35.28,56.49 35.33,56.44 SOCKETT1001.3 | SOCKETT1001.3 SOCKETT1006.3 35.31,47.25 SOCKETT1005.3 | SOCKETT1005.4 32.79,37.76 SOCKETT1006.4 | SOCKETT1004.4 SOCKETT1004.3
  Bottom 3.81: GND3.1 97.4,75.04 93.37,79.06 92.2,79.06 91.03,80.23 90.18,80.23 89.59,80.82 87.25,80.82 86.08,81.99 83.93,81.99 83.22,82.7 80.48,82.7 80.24,82.46 GND2.1
  Bottom 4.5: 71.17,83.3 70.42,84.05 65.98,84.05 65.2,83.27 56.22,83.27 56.06,83.43
  Bottom 5: 113.52,35.66 103.73,35.66 101.09,33.02 97.54,33.02 96.27,31.75 96.27,23.99 95.43,23.15 | GND1.1 44.04,76.78 47.74,80.49 51.8,80.49 54.22,82.91 55.54,82.91 56.06,83.43 | 71.17,83.3 71.3,83.17 72.21,83.17 74.75,83.17
  Bottom 6: PLUGT1001.- 85.34,6.52 | 85.34,6.52 PLUGT1002.- | 85.34,6.52 76,6.52 76,6.81 75.79,6.81 PLUGT1003.- PLUGT1006.- | 94.3,23.32 96.86,20.76 96.87,20.76 | 99.71,20.76 96.87,20.76 | 96.87,20.76 94.15,23.49 J1.-
  Bottom 6.452: PLUGT1001.- 94.36,6.81 94,6.81 94,6.58 PLUGT1005.- 117.24,6.81 | 117.24,6.81 PLUGT1004.- | 98.22,20.35 95.43,23.15 94.63,23.94 94.63,24.04 95.11,24.52 | 117.24,6.81 119.26,6.81 121.03,8.58 121.03,8.59 123.14,10.7 123.14,11.58 123.45,11.89 123.45,15.94 123.12,16.27 123.12,16.58 118.54,21.16 118.54,27.41 120.15,29.02 120.15,32.18 116.74,35.59 113.59,35.59 113.52,35.66
N$24
  Bottom 5: IC3.5 80.66,39.24 U$1.C2 88.21,39.24 88.06,39.09 94.3,39.09 94.85,39.64
  Bottom 6.452: SPACER+4.1 120.53,43.54 108.66,43.54 106.83,41.71 96.92,41.71 94.85,39.64
N$25
  Bottom 1.422: X1.10 67.68,66 67.68,67.31 63.64,71.35 X3.4
N$26
  Bottom 1.422: X1.8 65.55,65.59 65.55,66.77 61.1,71.22 X3.3
N$27
  Bottom 1.422: X2.3 46.3,65.78 47.12,64.96 56.34,64.96 56.82,65.44 58.1,65.44 58.26,65.28 58.24,65.28 X1.2
N$28
  Bottom 1.422: X1.18 78.36,66.7 79.2,67.54 89.51,67.54 90.73,66.32 SERVOTILT.1
N$44  (1 unrouted)
  Bottom 1.422: IC2.2 47.29,24.93 46.91,29.05 45.92,30.04 X7.1 50.75,43 50.75,45.77 51.57,46.59
N$45
  Bottom 2: X1.19 83.97,59.87 83.97,54.95 85.65,53.27 85.68,53.27 86.9,52.05 89.57,52.05 90.56,51.06 90.56,44.4 U$1.A1
N$46  (via drill 0.01 pad 10)
  other vias: 72.7,30.29
N$47  (via drill 0.01 pad 10)
  other vias: 61.61,30.29
N$48
  Bottom 1.422: IC3.1 69.83,52.2 | 69.83,52.2 71.07,53.44 TEMP.1 | IC1.3 70.82,51.21 69.83,52.2
N$49
  Bottom 5: U$1.A2 88.8,33.64 86.9,31.74 86.9,23.56 86.32,22.98 86.32,22.61 86.9,22.03
  Bottom 6: IC3.4 64.12,30.16 64.12,32.4 59.57,32.4 59.57,28.27 63.74,28.27 63.66,21.87 86.9,22.03 87.18,22.03 86.86,22.75 J1.+
N$50
  Bottom 3: 48.64,74.64 49.31,74.64 49.31,74.14
N$51
  Bottom 1.93: 74.89,28.36 74.94,28.41 75.05,28.41
  Bottom 6: 74.89,32.26 74.81,32.18 74.81,28.96 74.18,28.33 70.59,28.33 70.59,32.16 70.83,32.4 74.81,32.4 74.81,28.33 | 74.81,28.25 74.81,28.33 | 74.81,28.33 74.89,28.25 75.05,28.41
N$52
  Bottom 1.422: 54.86,5.97 PLUGCAM3&4.3 56.12,6.13 arc45 56.82,6.42 58.01,7.61 58.01,10.26 arc45 57.72,10.96 57.47,11.21 PLUGCAM3&4.1 arc45 PLUGCAM3&4.1 62.06,11.21 arc45 62.77,11.5 PLUGT1006.+ | 54.86,5.97 arc45 55.04,6.04 | 106.04,14.16 106.04,18.58 PLUGBACKUP.1 | 54.86,5.97 56.04,5.97 arc45 56.74,6.26 58.28,7.8 58.28,10.39 arc45 57.99,11.09 57.9,11.18 50.26,11.18 | 50.26,11.18 47.35,11.18 arc-45 PLUGCAM1&2.1 46.66,11.05 45.67,11.05 44.02,9.4 44.02,7.85 45.61,6.27 PLUGCAM1&2.3 46.55,5.86 PLUGSWITCH.1 28.11,5.86 22.05,11.93 K1.P 22.05,16.03 22.28,15.79 19.7,15.79 17.35,18.14 7.14,18.14 7.07,18.07 7.07,33.37 7.54,33.84 7.65,33.84 SPACER+2.1 | IC1.1 80.56,46.6 79.15,45.19 78.08,45.19 72.07,38.58 54.85,38.45 53.11,37.31 53.11,37.3 52.85,36.23 52.85,24.82 51.24,24.02 50.44,24.02 | 50.44,24.02 49.91,24.55 49.91,24.65 IC2.3 | 50.44,24.02 50.44,11.36 50.26,11.18
  Bottom 5: PLUGT1001.+ 93.62,13.6 102.41,13.6 | PLUGT1002.+ 75.05,13.46 PLUGT1003.+ | PLUGT1004.+ 102.41,13.6 | 102.41,13.6 105.87,13.71 | 105.87,13.71 PLUGT1005.+ | U$1.NO 105.87,29.88 105.87,13.71 | SPACER+1.1 7.29,19.03 SPACER+3.1 6.03,32.2 SPACER+2.1
  Bottom 6: PLUGT1006.+ PLUGT1003.+ | PLUGT1001.+ 93.62,13.46 PLUGT1002.+
  Bottom 6.452: 106.04,14.16 PLUGT1005.+
N$54  (via drill 1 pad 2.18)
  other vias: 63.14,65.49
N$55
  Bottom 1.422: X1.12 70.74,68.59 | 70.74,68.59 70.74,68.84 71.93,70.03 71.93,72.4 X4.2 | 70.74,68.59 70.28,69.05 68.69,69.05 66.7,71.04 66.7,78.01 R1.1
N$56
  Bottom 1.422: X5.2 78.39,71.88 78.39,71.24 78.18,71.24 76.44,69.5 75.79,69.5 75.64,69.35 | 75.64,69.35 73.35,67.06 73.35,65.55 X1.14 | 72.06,75.54 72.02,75.58 72.06,75.62 | 72.19,75.41 73.33,74.27 73.34,74.27 74.1,73.51 74.1,70.88 75.64,69.35 | R2.1 72.19,75.41 | 72.19,75.41 72.06,75.54 | 72.06,75.54 72.06,75.62 | 72.06,75.63 72.06,75.62
  Bottom 1.5: 73.62,65.82 X1.14
N$57
  Bottom 1.422: X6.2 90.82,69.28 85.93,69.28 R3.1 83.98,71.03 83.98,69.56 83.81,69.39 78.66,69.39 76.33,67.06 76.33,65.99 X1.16
N$58  (via drill 1 pad 2.18)
  other vias: 65.65,65.5
N$59  (via drill 1 pad 2.18)
  other vias: 68.19,65.49
N$60  (via drill 1 pad 2.18)
  other vias: 70.73,65.49
N$61  (via drill 1 pad 2.18)
  other vias: 73.28,65.49
N$62  (via drill 1 pad 2.18)
  other vias: 75.82,65.49
N$63  (via drill 1 pad 2.18)
  other vias: 78.36,65.49
N$64  (via drill 1 pad 2.18)
  other vias: 80.9,65.49
N$65  (via drill 1 pad 2.18)
  other vias: 80.9,62.95
N$66  (via drill 1 pad 2.18)
  other vias: 78.36,62.95
N$67  (via drill 1 pad 2.18)
  other vias: 75.82,62.98
N$68  (via drill 1 pad 2.18)
  other vias: 73.28,62.95
N$69  (via drill 1 pad 2.18)
  other vias: 70.73,62.95
N$70  (via drill 1 pad 2.18)
  other vias: 68.19,62.95
N$71  (via drill 1 pad 2.18)
  other vias: 65.65,62.95
N$72  (via drill 1 pad 2.18)
  other vias: 63.11,62.95
N$73  (via drill 1 pad 2.18)
  other vias: 60.57,62.95
N$74  (via drill 1 pad 2.18)
  other vias: 58.06,62.95
N$76
  Bottom 3: 49.28,74.22 48.67,74.22 48.67,75 49.31,75 49.31,74.84
N$77
  Bottom 3: 100.53,70.46 101.42,70.46 101.42,70.75 101.45,70.75 101.45,69.87 100.45,69.87 100.45,70
N$78
  Bottom 4: 90.62,51.19 90.68,51.19 90.68,44.09
N$79
  Bottom 1.016: X1.6 X1.3
  Bottom 1.422: X4.1 69.34,77.43 70.73,78.82 | 70.73,78.82 71.79,79.88 74.1,79.88 74.61,79.36 74.61,78.19 74.65,78.15 74.65,77.55 74.38,77.28 74.38,76.34 76.61,74.11 | X5.1 76.61,74.11 | 76.61,74.11 77.48,74.98 81.43,74.98 81.92,74.49 85.56,74.49 88.38,71.68 | X6.1 88.28,71.66 88.32,71.62 88.38,71.68 | 88.38,71.68 88.43,71.62 88.43,73.46 90.17,75.2 91.14,75.2 93.85,72.49 | 93.85,72.49 95.81,70.53 101.09,70.53 101.31,70.31 101.24,70.31 SPACER+6.1 | SERVOTILT.3 90.77,59.47 90.77,59.44 91.66,60.33 93.09,60.33 93.85,61.09 93.85,72.49 | 58.34,71.96 58.34,76.59 60.06,76.59 63.33,79.86 68.93,79.86 69.9,78.89 69.9,78.82 | 69.76,78.82 69.9,78.82 | 69.9,78.82 70.73,78.82 | 58.34,71.96 57.08,70.7 55.52,70.7 53.64,72.58 53.64,74.14 52.47,75.31 49.65,75.31 48.95,74.61 48.9,74.61 | 48.9,74.61 SPACER+5.1 | 48.9,74.61 48.35,74.61 | 48.35,74.61 47.84,74.61 46.4,73.17 | X2.2 43.76,69.88 48.35,74.47 48.35,74.61 | 58.34,71.96 58.34,71.25 63.16,66.43 63.16,65.43 63.12,65.47 X1.6 | 58.34,71.96 58.49,72.11 58.49,72.71 58.56,72.78 X3.2 | 52.76,59.25 52.49,58.98 | 52.49,58.98 52.07,58.56 52.07,56.96 U$2.P$10 | X1.3 60.58,62.52 57.9,59.84 53.42,59.84 52.52,58.94 52.49,58.98
S$12
  Bottom 1: 95.5,9.31 93.5,9.31
(copper drawn outside any net)
  shapes: Bottom area x2557